# EAGLE design ioThing-schematic (EAGLE 9.1.3)
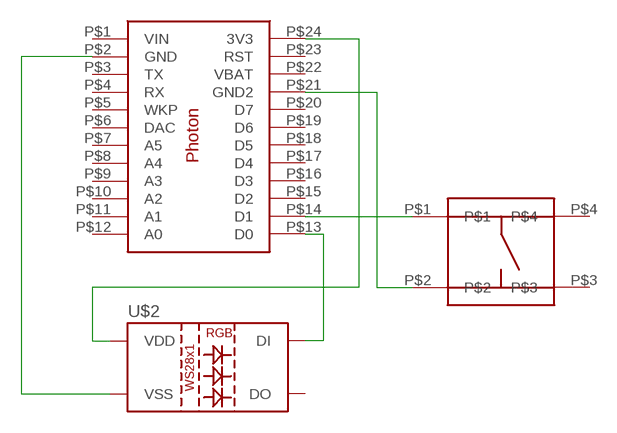
[diagram p0: schematic, sheet 1]

## Parts
U$1  PHOTON  [PHOTON]
U$2  5MM-NEOPIXEL  [T1-3/4-LED]
U$3  TACTILE_SWITCH  [TACTILE_SWITCH]

## Nets
N$1: U$1.P$24(3V3) U$2.P$2(VDD)
N$2: U$1.P$2(GND) U$2.P$3(VSS)
N$3: U$1.P$13(D0) U$2.P$1(DI)
N$4: U$1.P$14(D1) U$3.P$1
N$5: U$1.P$21(GND2) U$3.P$2
Unconnected: U$1.P$1(VIN) U$1.P$3(TX) U$1.P$4(RX) U$1.P$5(WKP) U$1.P$6(DAC) U$1.P$7(A5) U$1.P$8(A4) U$1.P$9(A3) U$1.P$10(A2) U$1.P$11(A1) U$1.P$12(A0) U$1.P$15(D2) U$1.P$16(D3) U$1.P$17(D4) U$1.P$18(D5) U$1.P$19(D6) U$1.P$20(D7) U$1.P$22(VBAT) U$1.P$23(RST) U$2.P$4(DO) U$3.P$3 U$3.P$4

## Library data of the parts
U$1 = ioThing:PHOTON
U$2 = ioThing:5MM-NEOPIXEL
U$3 = ioThing:TACTILE_SWITCH

## Board
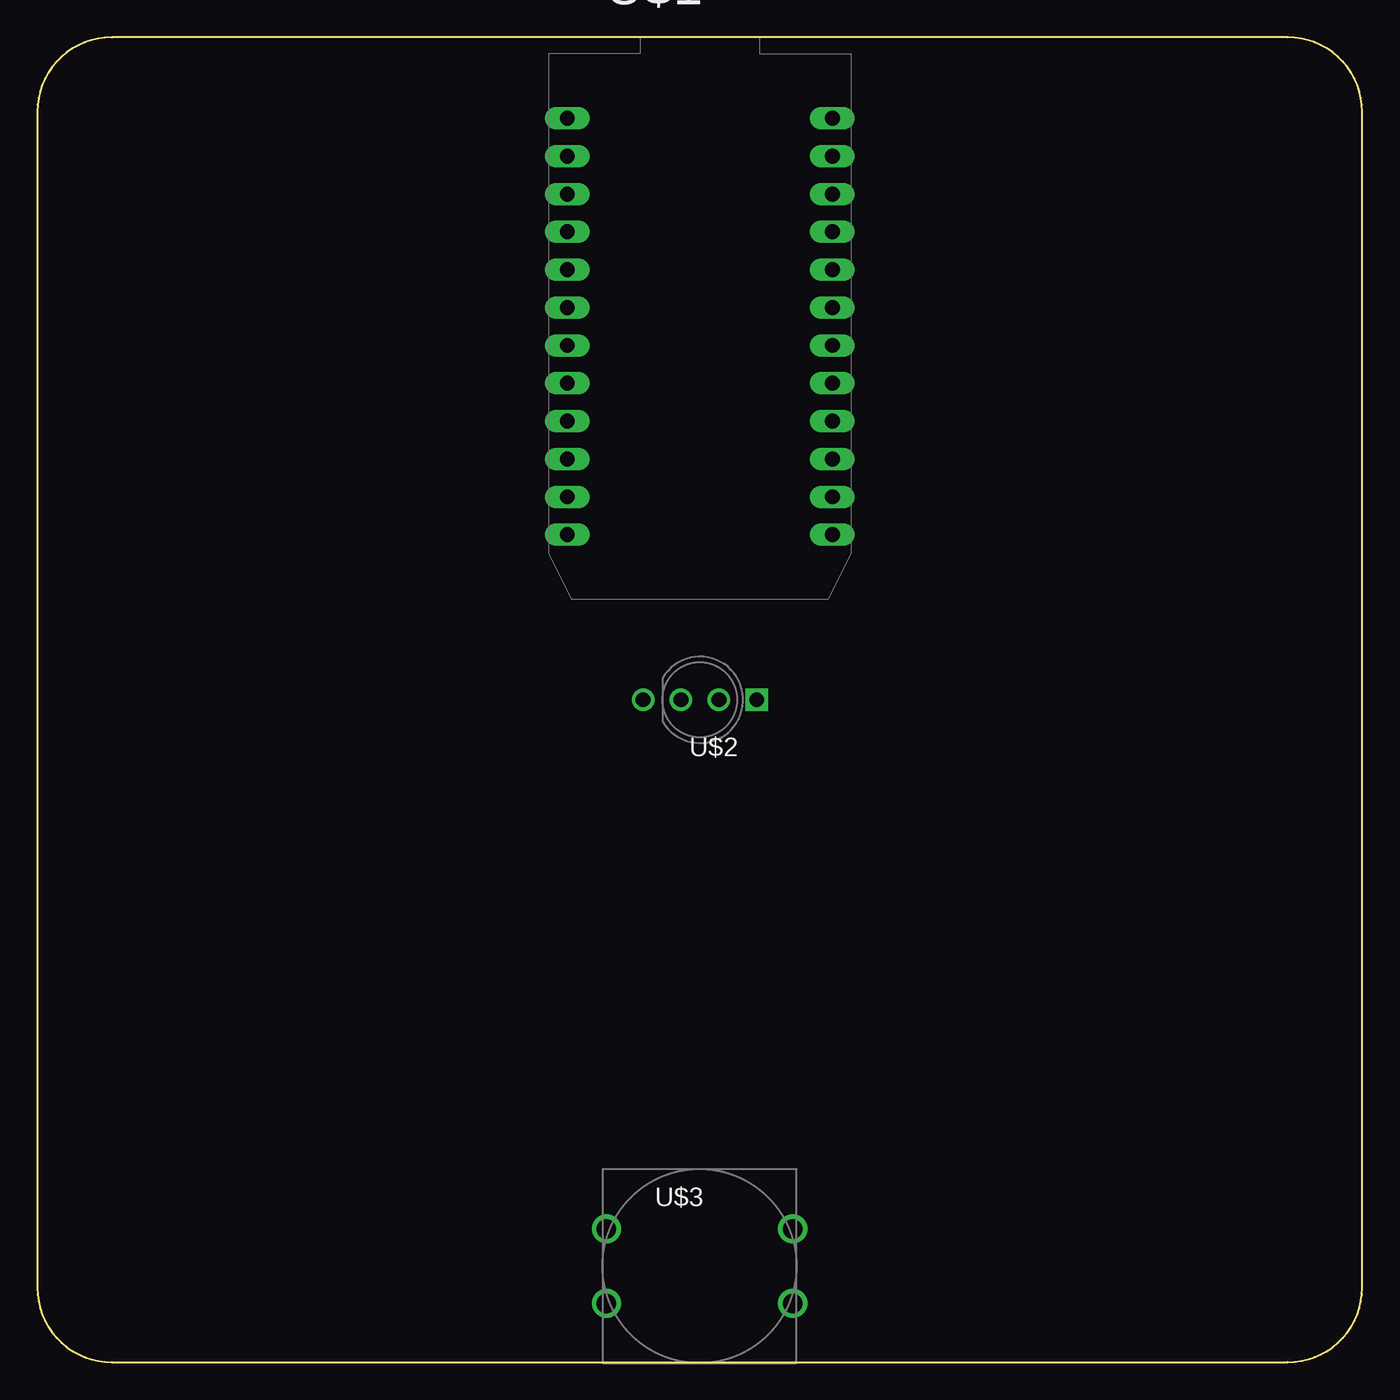
[diagram p1: board, top side]
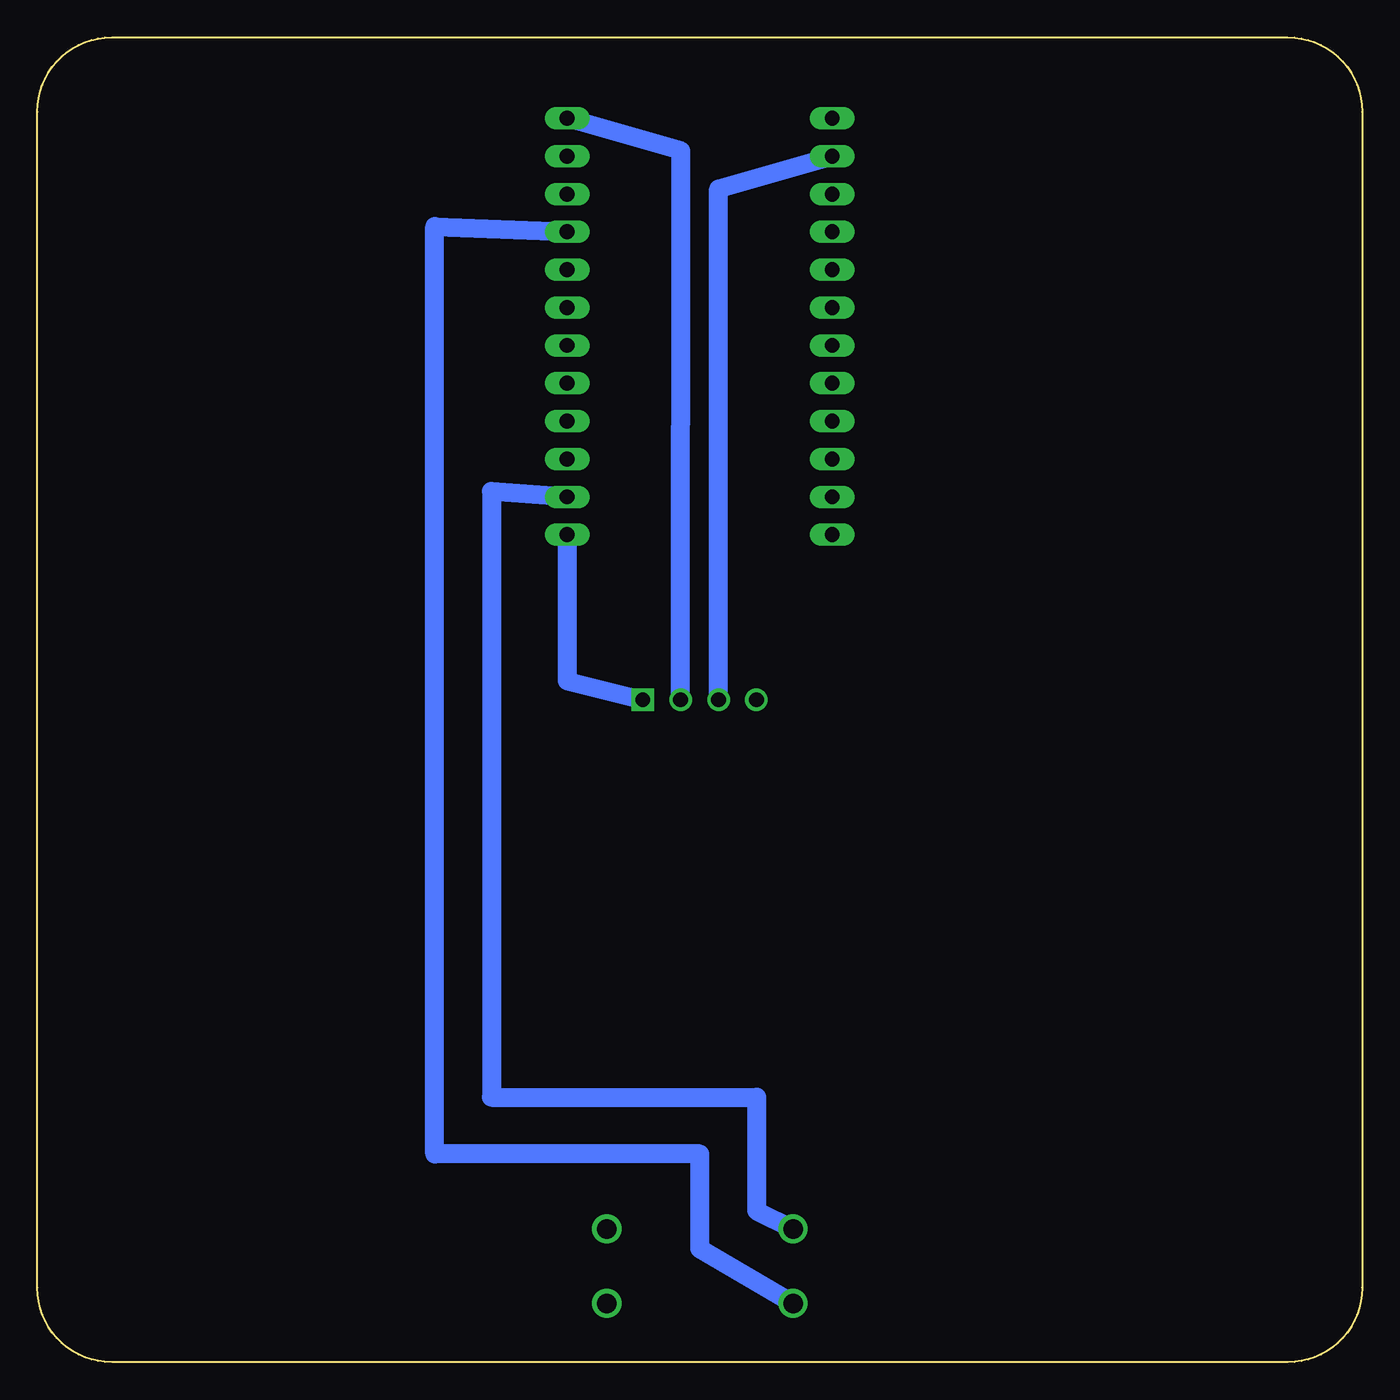
[diagram p2: board, bottom side, seen from below]

Size 88.9 x 88.9 mm. Coordinates in mm from the lower left corner, seen from the top.
Outline: 83.9,88.9 5,88.9 arc90 0,83.9 0,5 arc90 5,0 83.9,0 arc90 88.9,5 88.9,83.9 arc90 83.9,88.9
Copper layers (1*16): Top 0.035mm / dielectric 1.5mm / Bottom 0.035mm
Design rules "default": minimum track width 6mil, minimum drill 0.35mm, track to track 6mil, track to pad 6mil, pad to pad 6mil, via to via 6mil, smd to smd 6mil, copper to edge 40mil, drill to drill 6mil, minimum pad ring 10mil, minimum via ring 8mil, stop-mask expansion 4mil, vias tented up to drill 0mil, thermal gap 10mil

### Footprints (pad centres in the part's own frame; a part is rotated, then mirrored left to right if it is on the bottom)
PHOTON = drill 1 long: P$1 0,27.94; P$2 0,25.4; P$3 0,22.86; P$4 0,20.32; P$5 0,17.78; P$6 0,15.24; P$7 0,12.7; P$8 0,10.16; P$9 0,7.62; P$10 0,5.08; P$11 0,2.54; P$12 0,0; P$13 17.78,0; P$14 17.78,2.54; P$15 17.78,5.08; P$16 17.78,7.62; P$17 17.78,10.16; P$18 17.78,12.7; P$19 17.78,15.24; P$20 17.78,17.78; P$21 17.78,20.32; P$22 17.78,22.86; P$23 17.78,25.4; P$24 17.78,27.94
T1-3/4-LED = drill 1 square: P$1 -3.81,0 | drill 1: P$2 -1.27,0; P$3 1.27,0; P$4 3.81,0
TACTILE_SWITCH = drill 1.3: P$1 -6.25,2.5; P$2 -6.25,-2.5; P$3 6.25,-2.5; P$4 6.25,2.5

### Placement (x,y rotation side)
U$1  35.56,55.52 0 top
U$2  44.46,44.45 180 top
U$3  44.44,6.45 0 top

### Tracks (layer width: path | path; a pad name or v marks a point on that pad's centre or on a via)
N$1
  Bottom 1.27: U$2.P$2 45.72,81.28 U$1.P$24
N$2
  Bottom 1.27: U$2.P$3 43.18,78.74 U$1.P$2
N$3
  Bottom 1.27: U$1.P$13 53.34,45.72 U$2.P$1
N$4
  Bottom 1.27: U$3.P$1 40.64,10.16 40.64,17.78 58.42,17.78 58.42,58.42 U$1.P$14
N$5
  Bottom 1.27: U$3.P$2 44.45,7.62 44.45,13.97 62.23,13.97 62.23,76.2 U$1.P$21